# Altium schematic sheet B2B_Connector.SchDoc
size A4; SheetNumber: 9; SheetTotal: 9
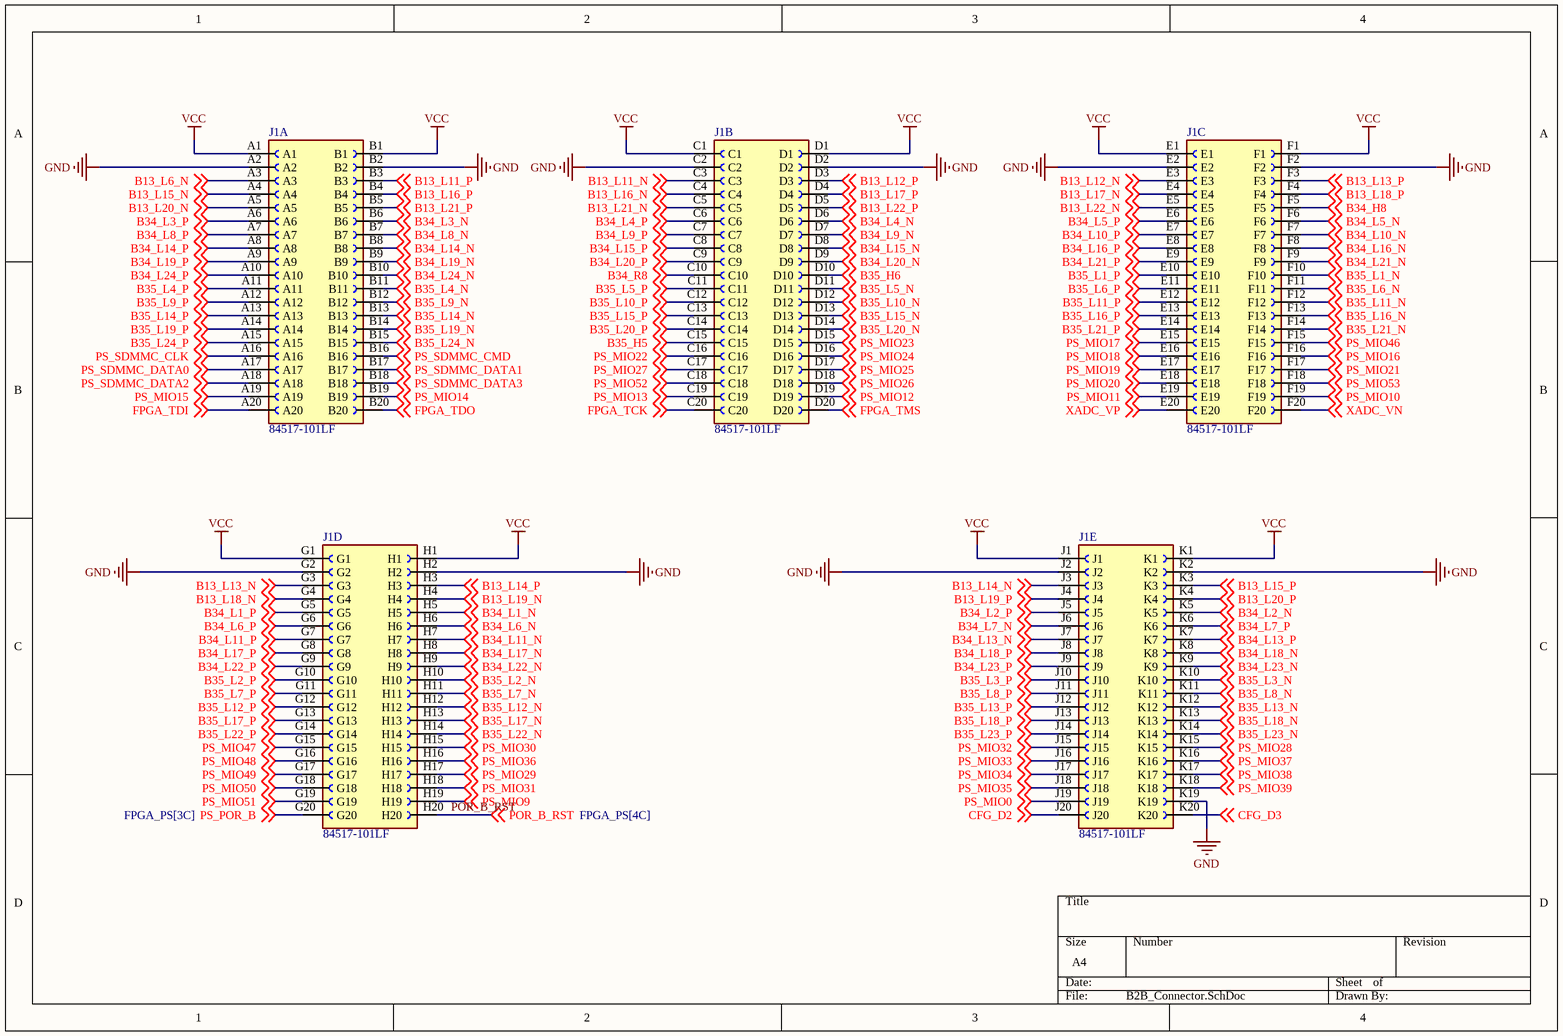
[diagram p0: B2B_Connector.SchDoc]

## Parts
J1  84517-101LF  [AMPHENOL_84517-101LF]  (parts A,B,C,D,E of 5)

## Nets
GND: J1.A2 J1.B2 J1.C2 J1.D2 J1.E2 J1.F2 J1.G2 J1.H2 J1.J2 J1.K2 J1.K19
VCC: J1.A1 J1.B1 J1.C1 J1.D1 J1.E1 J1.F1 J1.G1 J1.H1 J1.J1 J1.K1
B13_L6_N: J1.A3 ; off-sheet B13_L6_N
B13_L11_N: J1.C3 ; off-sheet B13_L11_N
B13_L11_P: J1.B3 ; off-sheet B13_L11_P
B13_L12_N: J1.E3 ; off-sheet B13_L12_N
B13_L12_P: J1.D3 ; off-sheet B13_L12_P
B13_L13_N: J1.G3 ; off-sheet B13_L13_N
B13_L13_P: J1.F3 ; off-sheet B13_L13_P
B13_L14_N: J1.J3 ; off-sheet B13_L14_N
B13_L14_P: J1.H3 ; off-sheet B13_L14_P
B13_L15_N: J1.A4 ; off-sheet B13_L15_N
B13_L15_P: J1.K3 ; off-sheet B13_L15_P
B13_L16_N: J1.C4 ; off-sheet B13_L16_N
B13_L16_P: J1.B4 ; off-sheet B13_L16_P
B13_L17_N: J1.E4 ; off-sheet B13_L17_N
B13_L17_P: J1.D4 ; off-sheet B13_L17_P
B13_L18_N: J1.G4 ; off-sheet B13_L18_N
B13_L18_P: J1.F4 ; off-sheet B13_L18_P
B13_L19_N: J1.H4 ; off-sheet B13_L19_N
B13_L19_P: J1.J4 ; off-sheet B13_L19_P
B13_L20_N: J1.A5 ; off-sheet B13_L20_N
B13_L20_P: J1.K4 ; off-sheet B13_L20_P
B13_L21_N: J1.C5 ; off-sheet B13_L21_N
B13_L21_P: J1.B5 ; off-sheet B13_L21_P
B13_L22_N: J1.E5 ; off-sheet B13_L22_N
B13_L22_P: J1.D5 ; off-sheet B13_L22_P
B34_H8: J1.F5 ; off-sheet B34_H8
B34_L1_N: J1.H5 ; off-sheet B34_L1_N
B34_L1_P: J1.G5 ; off-sheet B34_L1_P
B34_L2_N: J1.K5 ; off-sheet B34_L2_N
B34_L2_P: J1.J5 ; off-sheet B34_L2_P
B34_L3_N: J1.B6 ; off-sheet B34_L3_N
B34_L3_P: J1.A6 ; off-sheet B34_L3_P
B34_L4_N: J1.D6 ; off-sheet B34_L4_N
B34_L4_P: J1.C6 ; off-sheet B34_L4_P
B34_L5_N: J1.F6 ; off-sheet B34_L5_N
B34_L5_P: J1.E6 ; off-sheet B34_L5_P
B34_L6_N: J1.H6 ; off-sheet B34_L6_N
B34_L6_P: J1.G6 ; off-sheet B34_L6_P
B34_L7_N: J1.J6 ; off-sheet B34_L7_N
B34_L7_P: J1.K6 ; off-sheet B34_L7_P
B34_L8_N: J1.B7 ; off-sheet B34_L8_N
B34_L8_P: J1.A7 ; off-sheet B34_L8_P
B34_L9_N: J1.D7 ; off-sheet B34_L9_N
B34_L9_P: J1.C7 ; off-sheet B34_L9_P
B34_L10_N: J1.F7 ; off-sheet B34_L10_N
B34_L10_P: J1.E7 ; off-sheet B34_L10_P
B34_L11_N: J1.H7 ; off-sheet B34_L11_N
B34_L11_P: J1.G7 ; off-sheet B34_L11_P
B34_L13_N: J1.J7 ; off-sheet B34_L13_N
B34_L13_P: J1.K7 ; off-sheet B34_L13_P
B34_L14_N: J1.B8 ; off-sheet B34_L14_N
B34_L14_P: J1.A8 ; off-sheet B34_L14_P
B34_L15_N: J1.D8 ; off-sheet B34_L15_N
B34_L15_P: J1.C8 ; off-sheet B34_L15_P
B34_L16_N: J1.F8 ; off-sheet B34_L16_N
B34_L16_P: J1.E8 ; off-sheet B34_L16_P
B34_L17_N: J1.H8 ; off-sheet B34_L17_N
B34_L17_P: J1.G8 ; off-sheet B34_L17_P
B34_L18_N: J1.K8 ; off-sheet B34_L18_N
B34_L18_P: J1.J8 ; off-sheet B34_L18_P
B34_L19_N: J1.B9 ; off-sheet B34_L19_N
B34_L19_P: J1.A9 ; off-sheet B34_L19_P
B34_L20_N: J1.D9 ; off-sheet B34_L20_N
B34_L20_P: J1.C9 ; off-sheet B34_L20_P
B34_L21_N: J1.F9 ; off-sheet B34_L21_N
B34_L21_P: J1.E9 ; off-sheet B34_L21_P
B34_L22_N: J1.H9 ; off-sheet B34_L22_N
B34_L22_P: J1.G9 ; off-sheet B34_L22_P
B34_L23_N: J1.K9 ; off-sheet B34_L23_N
B34_L23_P: J1.J9 ; off-sheet B34_L23_P
B34_L24_N: J1.B10 ; off-sheet B34_L24_N
B34_L24_P: J1.A10 ; off-sheet B34_L24_P
B34_R8: J1.C10 ; off-sheet B34_R8
B35_H5: J1.C15 ; off-sheet B35_H5
B35_H6: J1.D10 ; off-sheet B35_H6
B35_L1_N: J1.F10 ; off-sheet B35_L1_N
B35_L1_P: J1.E10 ; off-sheet B35_L1_P
B35_L2_N: J1.H10 ; off-sheet B35_L2_N
B35_L2_P: J1.G10 ; off-sheet B35_L2_P
B35_L3_N: J1.K10 ; off-sheet B35_L3_N
B35_L3_P: J1.J10 ; off-sheet B35_L3_P
B35_L4_N: J1.B11 ; off-sheet B35_L4_N
B35_L4_P: J1.A11 ; off-sheet B35_L4_P
B35_L5_N: J1.D11 ; off-sheet B35_L5_N
B35_L5_P: J1.C11 ; off-sheet B35_L5_P
B35_L6_N: J1.F11 ; off-sheet B35_L6_N
B35_L6_P: J1.E11 ; off-sheet B35_L6_P
B35_L7_N: J1.H11 ; off-sheet B35_L7_N
B35_L7_P: J1.G11 ; off-sheet B35_L7_P
B35_L8_N: J1.K11 ; off-sheet B35_L8_N
B35_L8_P: J1.J11 ; off-sheet B35_L8_P
B35_L9_N: J1.B12 ; off-sheet B35_L9_N
B35_L9_P: J1.A12 ; off-sheet B35_L9_P
B35_L10_N: J1.D12 ; off-sheet B35_L10_N
B35_L10_P: J1.C12 ; off-sheet B35_L10_P
B35_L11_N: J1.F12 ; off-sheet B35_L11_N
B35_L11_P: J1.E12 ; off-sheet B35_L11_P
B35_L12_N: J1.H12 ; off-sheet B35_L12_N
B35_L12_P: J1.G12 ; off-sheet B35_L12_P
B35_L13_N: J1.K12 ; off-sheet B35_L13_N
B35_L13_P: J1.J12 ; off-sheet B35_L13_P
B35_L14_N: J1.B13 ; off-sheet B35_L14_N
B35_L14_P: J1.A13 ; off-sheet B35_L14_P
B35_L15_N: J1.D13 ; off-sheet B35_L15_N
B35_L15_P: J1.C13 ; off-sheet B35_L15_P
B35_L16_N: J1.F13 ; off-sheet B35_L16_N
B35_L16_P: J1.E13 ; off-sheet B35_L16_P
B35_L17_N: J1.H13 ; off-sheet B35_L17_N
B35_L17_P: J1.G13 ; off-sheet B35_L17_P
B35_L18_N: J1.K13 ; off-sheet B35_L18_N
B35_L18_P: J1.J13 ; off-sheet B35_L18_P
B35_L19_N: J1.B14 ; off-sheet B35_L19_N
B35_L19_P: J1.A14 ; off-sheet B35_L19_P
B35_L20_N: J1.D14 ; off-sheet B35_L20_N
B35_L20_P: J1.C14 ; off-sheet B35_L20_P
B35_L21_N: J1.F14 ; off-sheet B35_L21_N
B35_L21_P: J1.E14 ; off-sheet B35_L21_P
B35_L22_N: J1.H14 ; off-sheet B35_L22_N
B35_L22_P: J1.G14 ; off-sheet B35_L22_P
B35_L23_N: J1.K14 ; off-sheet B35_L23_N
B35_L23_P: J1.J14 ; off-sheet B35_L23_P
B35_L24_N: J1.B15 ; off-sheet B35_L24_N
B35_L24_P: J1.A15 ; off-sheet B35_L24_P
CFG_D2: J1.J20 ; off-sheet CFG_D2
CFG_D3: J1.K20 ; off-sheet CFG_D3
FPGA_TCK: J1.C20 ; off-sheet FPGA_TCK
FPGA_TDI: J1.A20 ; off-sheet FPGA_TDI
FPGA_TDO: J1.B20 ; off-sheet FPGA_TDO
FPGA_TMS: J1.D20 ; off-sheet FPGA_TMS
POR_B_RST: J1.H20 ; off-sheet POR_B_RST
PS_MIO0: J1.J19 ; off-sheet PS_MIO0
PS_MIO9: J1.H19 ; off-sheet PS_MIO9
PS_MIO10: J1.F19 ; off-sheet PS_MIO10
PS_MIO11: J1.E19 ; off-sheet PS_MIO11
PS_MIO12: J1.D19 ; off-sheet PS_MIO12
PS_MIO13: J1.C19 ; off-sheet PS_MIO13
PS_MIO14: J1.B19 ; off-sheet PS_MIO14
PS_MIO15: J1.A19 ; off-sheet PS_MIO15
PS_MIO16: J1.F16 ; off-sheet PS_MIO16
PS_MIO17: J1.E15 ; off-sheet PS_MIO17
PS_MIO18: J1.E16 ; off-sheet PS_MIO18
PS_MIO19: J1.E17 ; off-sheet PS_MIO19
PS_MIO20: J1.E18 ; off-sheet PS_MIO20
PS_MIO21: J1.F17 ; off-sheet PS_MIO21
PS_MIO22: J1.C16 ; off-sheet PS_MIO22
PS_MIO23: J1.D15 ; off-sheet PS_MIO23
PS_MIO24: J1.D16 ; off-sheet PS_MIO24
PS_MIO25: J1.D17 ; off-sheet PS_MIO25
PS_MIO26: J1.D18 ; off-sheet PS_MIO26
PS_MIO27: J1.C17 ; off-sheet PS_MIO27
PS_MIO28: J1.K15 ; off-sheet PS_MIO28
PS_MIO29: J1.H17 ; off-sheet PS_MIO29
PS_MIO30: J1.H15 ; off-sheet PS_MIO30
PS_MIO31: J1.H18 ; off-sheet PS_MIO31
PS_MIO32: J1.J15 ; off-sheet PS_MIO32
PS_MIO33: J1.J16 ; off-sheet PS_MIO33
PS_MIO34: J1.J17 ; off-sheet PS_MIO34
PS_MIO35: J1.J18 ; off-sheet PS_MIO35
PS_MIO36: J1.H16 ; off-sheet PS_MIO36
PS_MIO37: J1.K16 ; off-sheet PS_MIO37
PS_MIO38: J1.K17 ; off-sheet PS_MIO38
PS_MIO39: J1.K18 ; off-sheet PS_MIO39
PS_MIO46: J1.F15 ; off-sheet PS_MIO46
PS_MIO47: J1.G15 ; off-sheet PS_MIO47
PS_MIO48: J1.G16 ; off-sheet PS_MIO48
PS_MIO49: J1.G17 ; off-sheet PS_MIO49
PS_MIO50: J1.G18 ; off-sheet PS_MIO50
PS_MIO51: J1.G19 ; off-sheet PS_MIO51
PS_MIO52: J1.C18 ; off-sheet PS_MIO52
PS_MIO53: J1.F18 ; off-sheet PS_MIO53
PS_POR_B: J1.G20 ; off-sheet PS_POR_B
PS_SDMMC_CLK: J1.A16 ; off-sheet PS_SDMMC_CLK
PS_SDMMC_CMD: J1.B16 ; off-sheet PS_SDMMC_CMD
PS_SDMMC_DATA0: J1.A17 ; off-sheet PS_SDMMC_DATA0
PS_SDMMC_DATA1: J1.B17 ; off-sheet PS_SDMMC_DATA1
PS_SDMMC_DATA2: J1.A18 ; off-sheet PS_SDMMC_DATA2
PS_SDMMC_DATA3: J1.B18 ; off-sheet PS_SDMMC_DATA3
XADC_VN: J1.F20 ; off-sheet XADC_VN
XADC_VP: J1.E20 ; off-sheet XADC_VP

## Library data of the parts
J1 = 84517-101LF: MEG-ARRAY LEAD FREE-200 POS RECP 4MM W/CAP | Amphenol FCI (Amphenol CS) 84517-101LF; MF: Amphenol ICC (FCI); SnapEDA_Link: https://www.snapeda.com/parts/84517-101LF/Amphenol+FCI/view-part/?ref=snap; Package: None; Value: *; MP: 84517-101LF; Check_prices: https://www.snapeda.com/parts/84517-101LF/Amphenol+FCI/view-part/?ref=eda